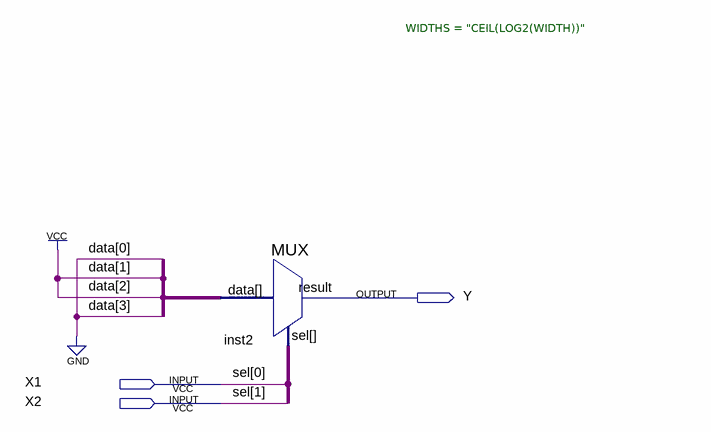
[diagram p0: schematic sheet]
// Quartus schematic iskl_ili.bdf as structural Verilog: 1 symbols, 3 pins
module iskl_ili (
  input  X1,
  input  X2,
  output Y
);

  wire undriven, undriven_2;

  MUX #(.WIDTHS("CEIL(LOG2(WIDTH))")) inst2 (.data(undriven), .sel(undriven_2), .result(Y));

  // Other names for the same wires on the sheet: sel[1:0] = {X2, X1}
endmodule
